# EAGLE design untitled (EAGLE 7.7.0)
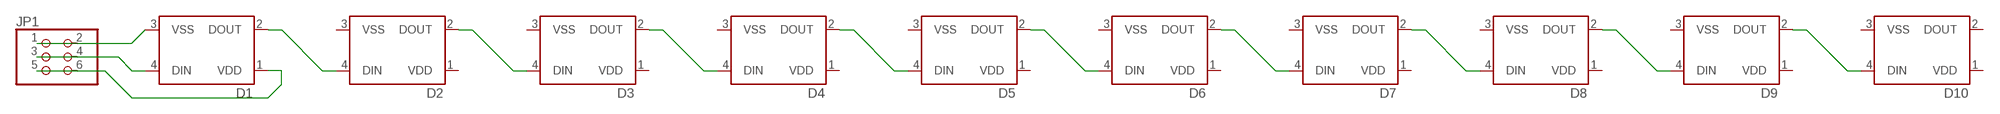
[diagram p0: schematic, sheet 1]

## Parts
D1  WS2812B  [WS2812B]
D2  WS2812B  [WS2812B]
D3  WS2812B  [WS2812B]
D4  WS2812B  [WS2812B]
D5  WS2812B  [WS2812B]
D6  WS2812B  [WS2812B]
D7  WS2812B  [WS2812B]
D8  WS2812B  [WS2812B]
D9  WS2812B  [WS2812B]
D10  WS2812B  [WS2812B]
JP1  PINHD-2X03_2.54-SMD  [2X03SMD]

## Nets
N$1: D1.2(DOUT) D2.4(DIN)
N$2: D2.2(DOUT) D3.4(DIN)
N$3: D3.2(DOUT) D4.4(DIN)
N$4: D4.2(DOUT) D5.4(DIN)
N$5: D5.2(DOUT) D6.4(DIN)
N$6: D6.2(DOUT) D7.4(DIN)
N$7: D7.2(DOUT) D8.4(DIN)
N$8: D8.2(DOUT) D9.4(DIN)
N$9: D9.2(DOUT) D10.4(DIN)
N$10: D1.4(DIN) JP1.3 JP1.4
N$12: D1.1(VDD) JP1.5 JP1.6
VSS: D1.3(VSS) JP1.1 JP1.2
Unconnected: D10.2(DOUT)

## Power pins joined to a net without a drawn wire
VDD: D2.1(VDD) D3.1(VDD) D4.1(VDD) D5.1(VDD) D6.1(VDD) D7.1(VDD) D8.1(VDD) D9.1(VDD) D10.1(VDD)
VSS: D2.3(VSS) D3.3(VSS) D4.3(VSS) D5.3(VSS) D6.3(VSS) D7.3(VSS) D8.3(VSS) D9.3(VSS) D10.3(VSS)

## Library data of the parts
D1-D10 = SparkFun-LED:WS2812B: WS2812B - Intelligent control LED integrated light source Technical Specifications: Power Supply Voltage (VDD): 3.5 to 5.3 V Input Voltage (VI): -0.5 to VDD+0.5 V Operating Junction Temperature (Topt): -25°C to +80°C Storage Temperature Range (Tstg): -55°C to +150°C; PROD_ID: DIO-12503
JP1 = pinhead-2:PINHD-2X03: PIN HEADER

## Board
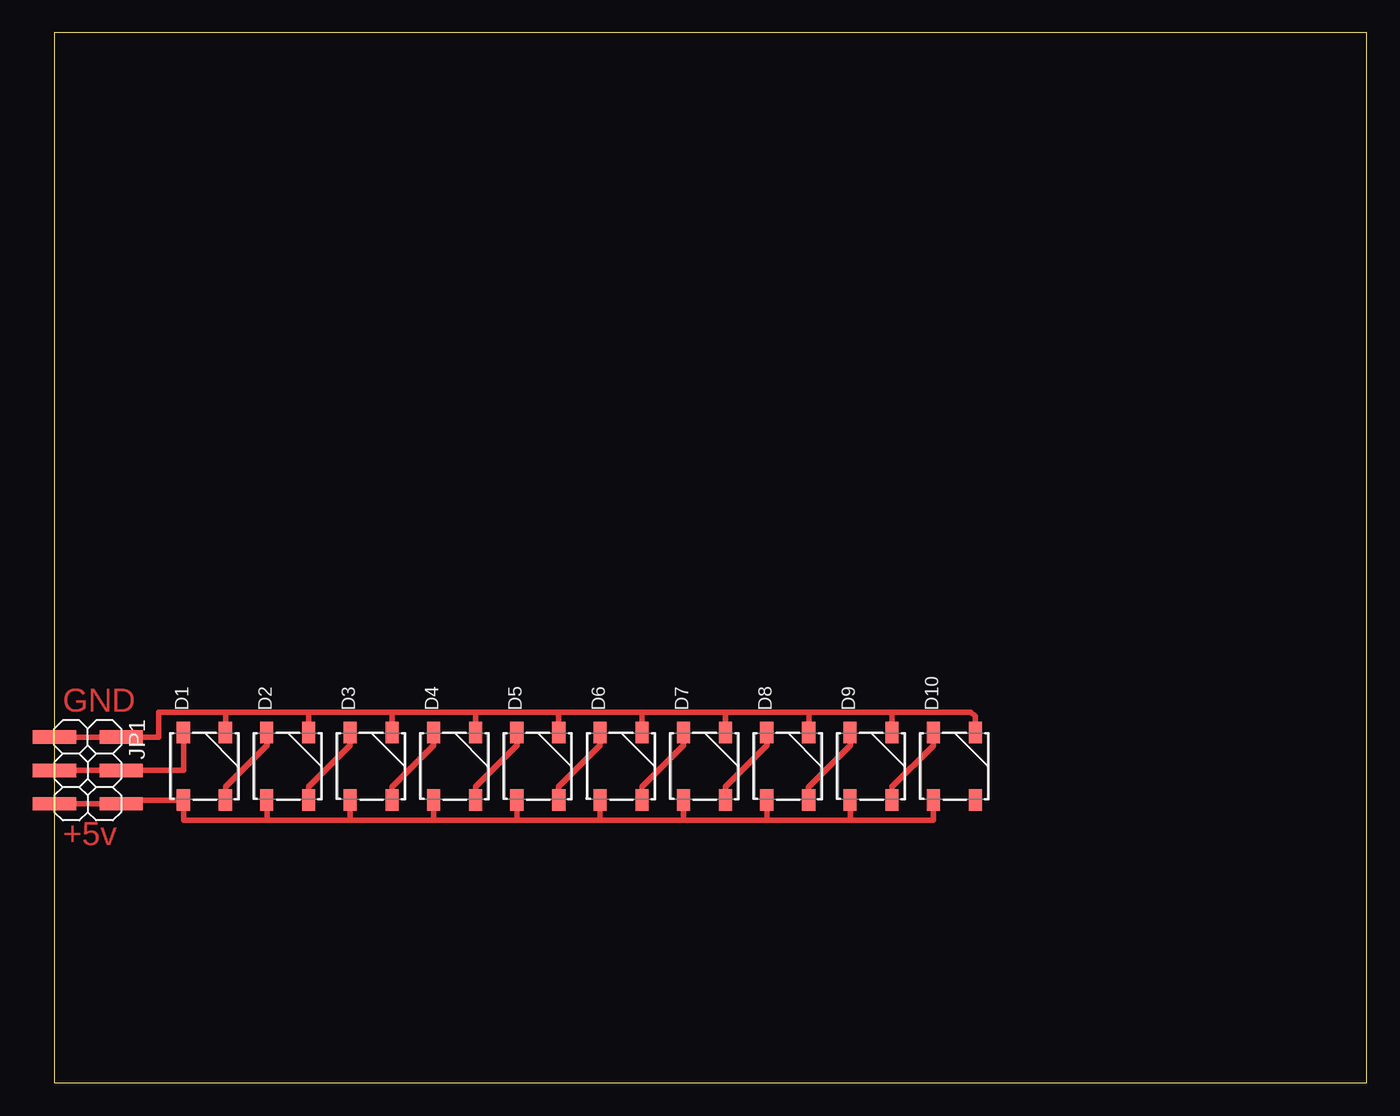
[diagram p1: board, top side]

Size 100 x 80 mm. Coordinates in mm from the lower left corner, seen from the top.
Outline: 0,0 100,0 100,80 0,80 0,0
Copper layers (1*16): Top 0.035mm / dielectric 1.5mm / Bottom 0.035mm
Design rules "default": minimum track width 10mil, minimum drill 24mil, track to track 8mil, track to pad 8mil, pad to pad 8mil, via to via 8mil, smd to smd 8mil, copper to edge 40mil, drill to drill 8mil, minimum pad ring 10mil, minimum via ring 8mil, stop-mask expansion 4mil, vias tented up to drill 0mil, thermal gap 10mil

### Footprints (pad centres in the part's own frame; a part is rotated, then mirrored left to right if it is on the bottom)
WS2812B = smd 1.651 x 1: 1 -2.577,1.6; 2 -2.577,-1.6; 3 2.577,-1.6; 4 2.577,1.6
2X03SMD = smd 1.016 x 3.302: 1 -1.27,-3.81; 2 -1.27,1.27; 3 1.27,-3.81; 4 1.27,1.27; 5 3.81,-3.81; 6 3.81,1.27

### Placement (x,y rotation side)
D1  11.43,24.13 90 top
D2  17.78,24.13 90 top
D3  24.13,24.13 90 top
D4  30.48,24.13 90 top
D5  36.83,24.13 90 top
D6  43.18,24.13 90 top
D7  49.53,24.13 90 top
D8  55.88,24.13 90 top
D9  62.23,24.13 90 top
D10  68.58,24.13 90 top
JP1  3.81,25.08 270 top

### Tracks (layer width: path | path; a pad name or v marks a point on that pad's centre or on a via)
N$1
  Top 0.406: D2.4 16.19,26.7 16.19,25.72 13.03,22.55 D1.2
N$2
  Top 0.406: D3.4 22.54,26.7 22.54,25.72 19.38,22.55 D2.2
N$3
  Top 0.406: D4.4 28.89,26.7 28.89,25.72 25.73,22.55 D3.2
N$4
  Top 0.406: D5.4 35.24,26.7 35.24,25.72 32.08,22.55 D4.2
N$5
  Top 0.406: D6.4 41.59,26.7 41.59,25.72 38.43,22.55 D5.2
N$6
  Top 0.406: D7.4 47.94,26.7 47.94,25.72 44.78,22.55 D6.2
N$7
  Top 0.406: D8.4 54.29,26.7 54.29,25.72 51.13,22.55 D7.2
N$8
  Top 0.406: D8.2 57.47,21.57 57.47,22.54 60.64,25.72 60.64,26.7 D9.4
N$9
  Top 0.406: D10.4 66.98,25.7 63.83,22.55 D9.2
N$10
  Top 0.406: JP1.3 JP1.4 9.83,23.81 D1.4
N$12
  Top 0.406: D1.1 5.36,21.55 JP1.6 JP1.5
VDD
  Top 0.406: 9.84,21.55 9.84,20 16.19,20 | 16.19,20 22.54,20 | 22.54,20 28.89,20 | 28.89,20 35.24,20 | 35.24,20 41.59,20 | 41.59,20 47.94,20 | 47.94,20 54.29,20 | 54.29,20 60.64,20 | 60.64,20 66.98,20 D10.1 | D9.1 60.64,21.55 60.64,20 | D8.1 54.29,21.55 54.29,20 | D7.1 47.94,21.55 47.94,20 | D6.1 41.59,21.55 41.59,20 | D5.1 35.24,21.55 35.24,20 | D4.1 28.89,21.55 28.89,20 | D3.1 22.54,21.55 22.54,20 | D2.1 16.19,21.55 16.19,20
VSS
  Top 0.406: 25.72,28.26 32.07,28.26 | 32.07,28.26 38.42,28.26 | 38.42,28.26 44.77,28.26 | 44.77,28.26 51.12,28.26 | 51.12,28.26 57.47,28.26 | 57.47,28.26 63.82,28.26 | 63.82,28.26 69.85,28.26 70.17,27.94 70.17,26.72 D10.3 | D9.3 63.83,28.25 63.82,28.26 | D8.3 57.48,28.25 57.47,28.26 | D7.3 51.13,28.25 51.12,28.26 | D6.3 44.78,28.25 44.77,28.26 | D5.3 38.43,28.25 38.42,28.26 | D4.3 32.08,28.25 32.07,28.26 | D3.3 25.73,28.25 25.72,28.26 | 25.72,28.26 19.38,28.26 | 19.38,28.26 13.03,28.26 | 19.38,28.26 D2.3 | JP1.1 JP1.2 7.94,26.35 7.94,28.26 13.03,28.26 | 13.03,28.26 D1.3

### Text on the board
Top: GND | +5v